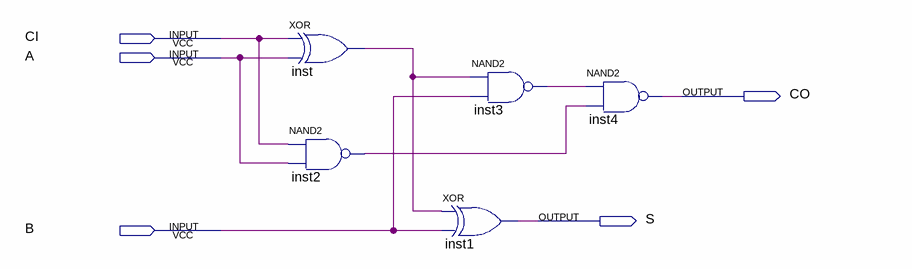
[diagram p0: schematic sheet]
// Quartus schematic EDA1.bdf as structural Verilog: 5 symbols, 5 pins
module EDA1 (
  input  CI,
  input  A,
  input  B,
  output CO,
  output S
);

  wire inst2_out, inst3_out, inst_out;

  xor inst (inst_out, CI, A);
  nand inst2 (inst2_out, CI, A);
  nand inst3 (inst3_out, inst_out, B);
  xor inst1 (S, inst_out, B);
  nand inst4 (CO, inst3_out, inst2_out);
endmodule
